# Altium schematic sheet 垃圾分类.SchDoc
size A2
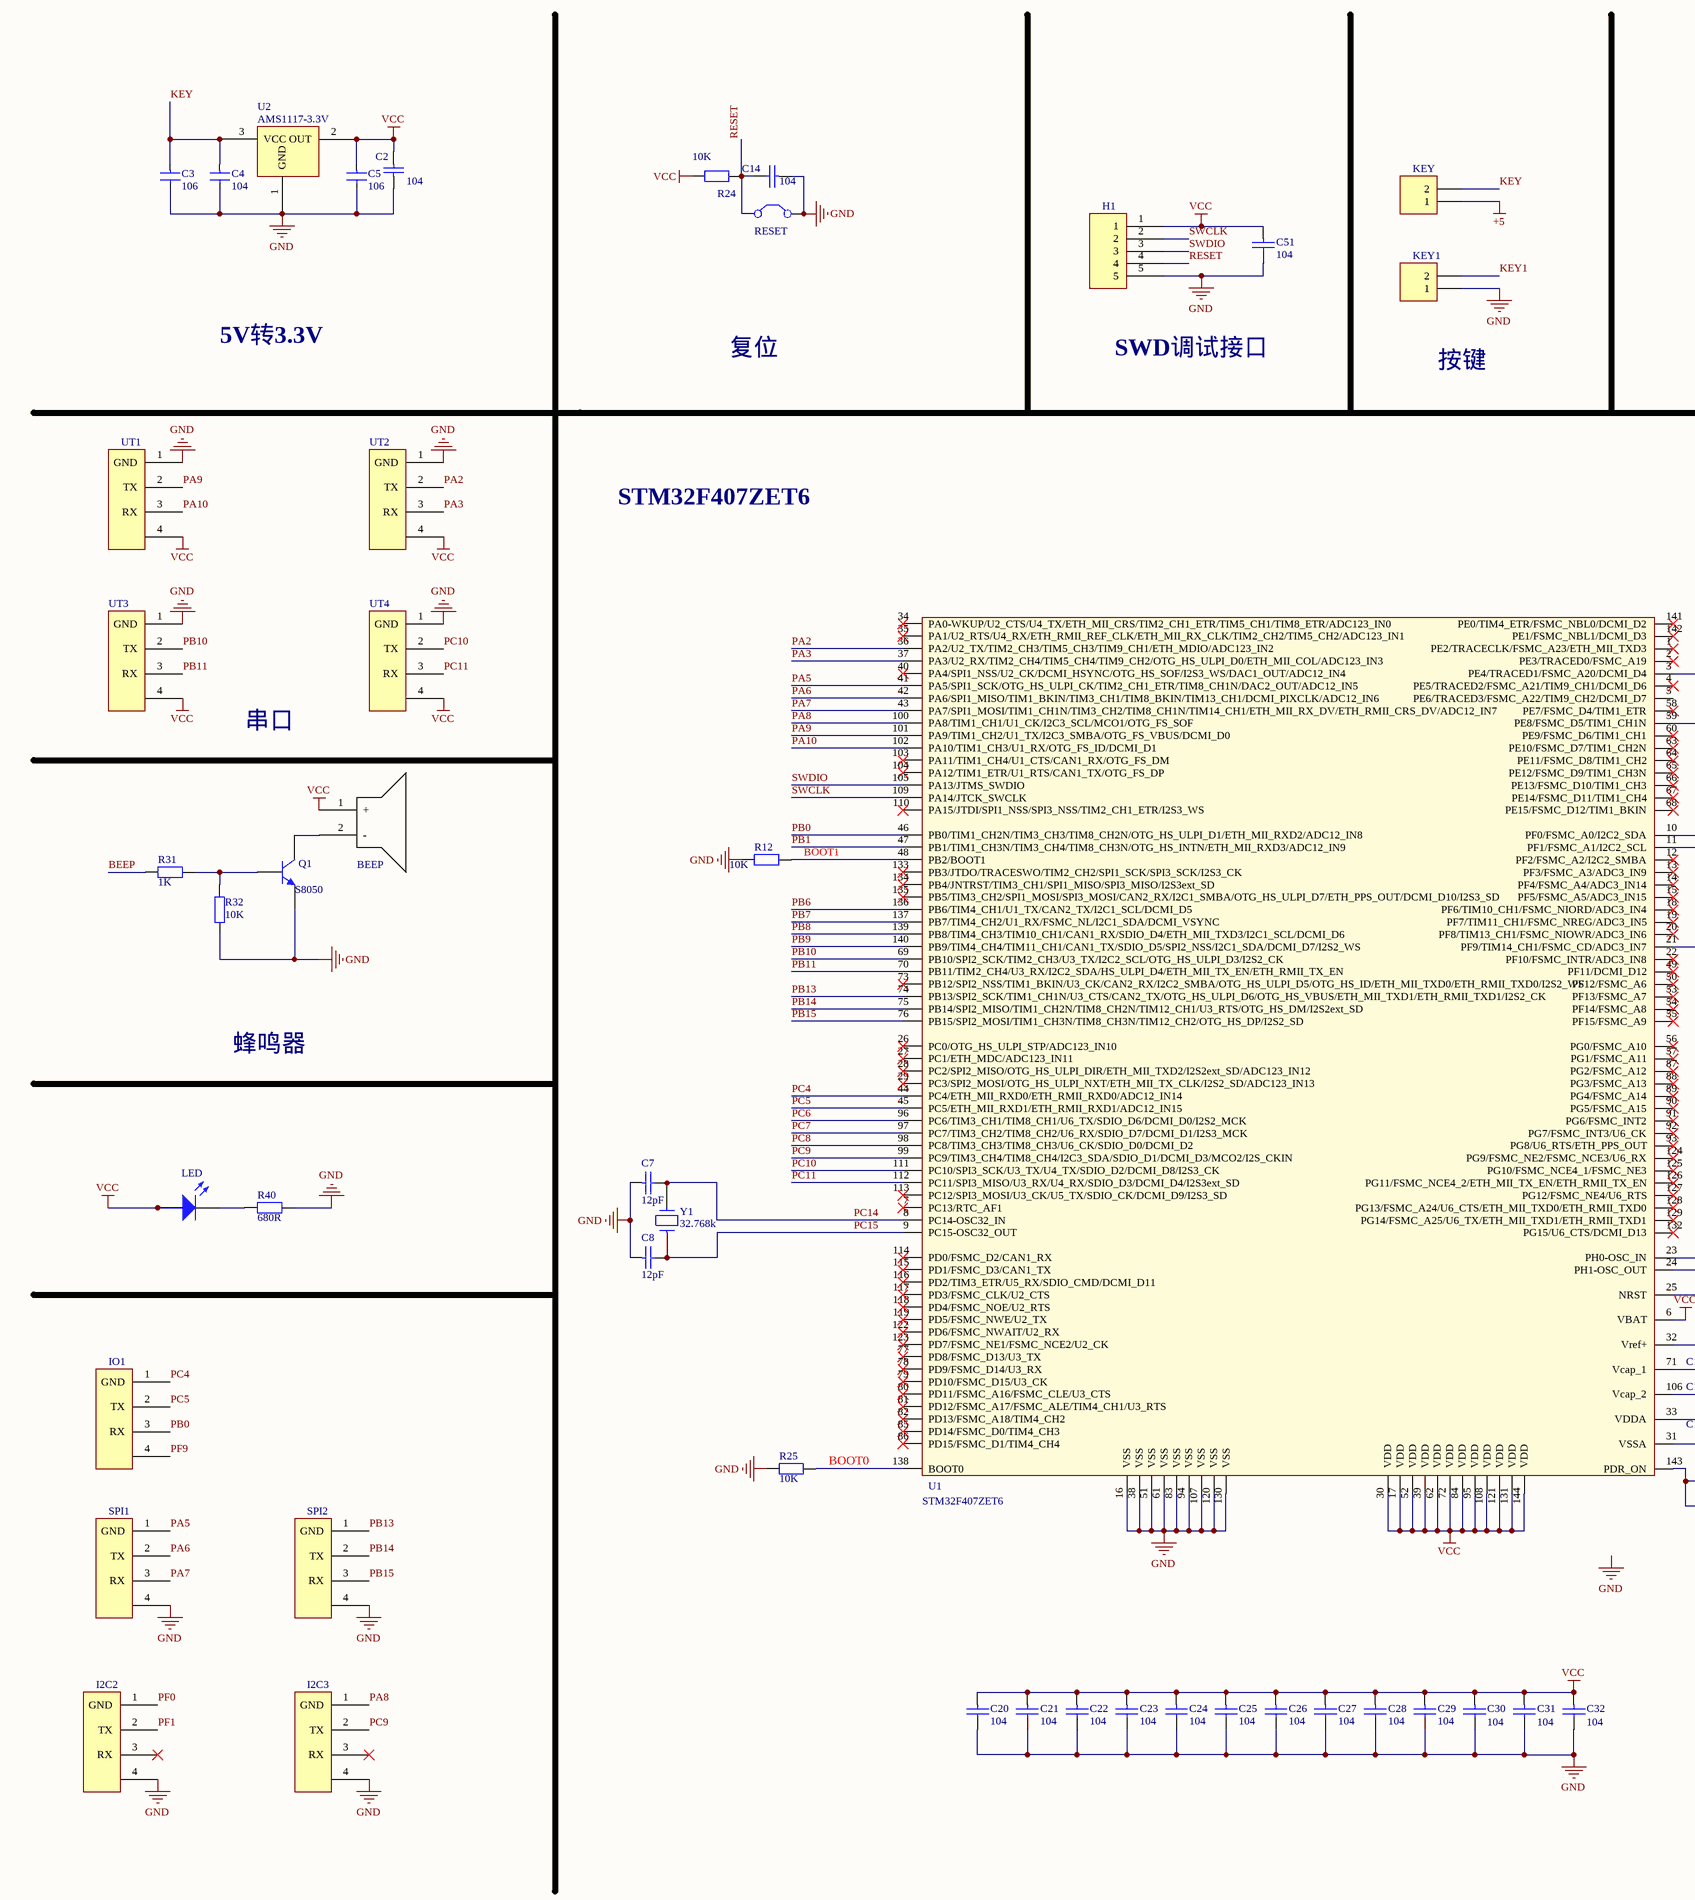
[diagram p0: 垃圾分类.SchDoc, left]
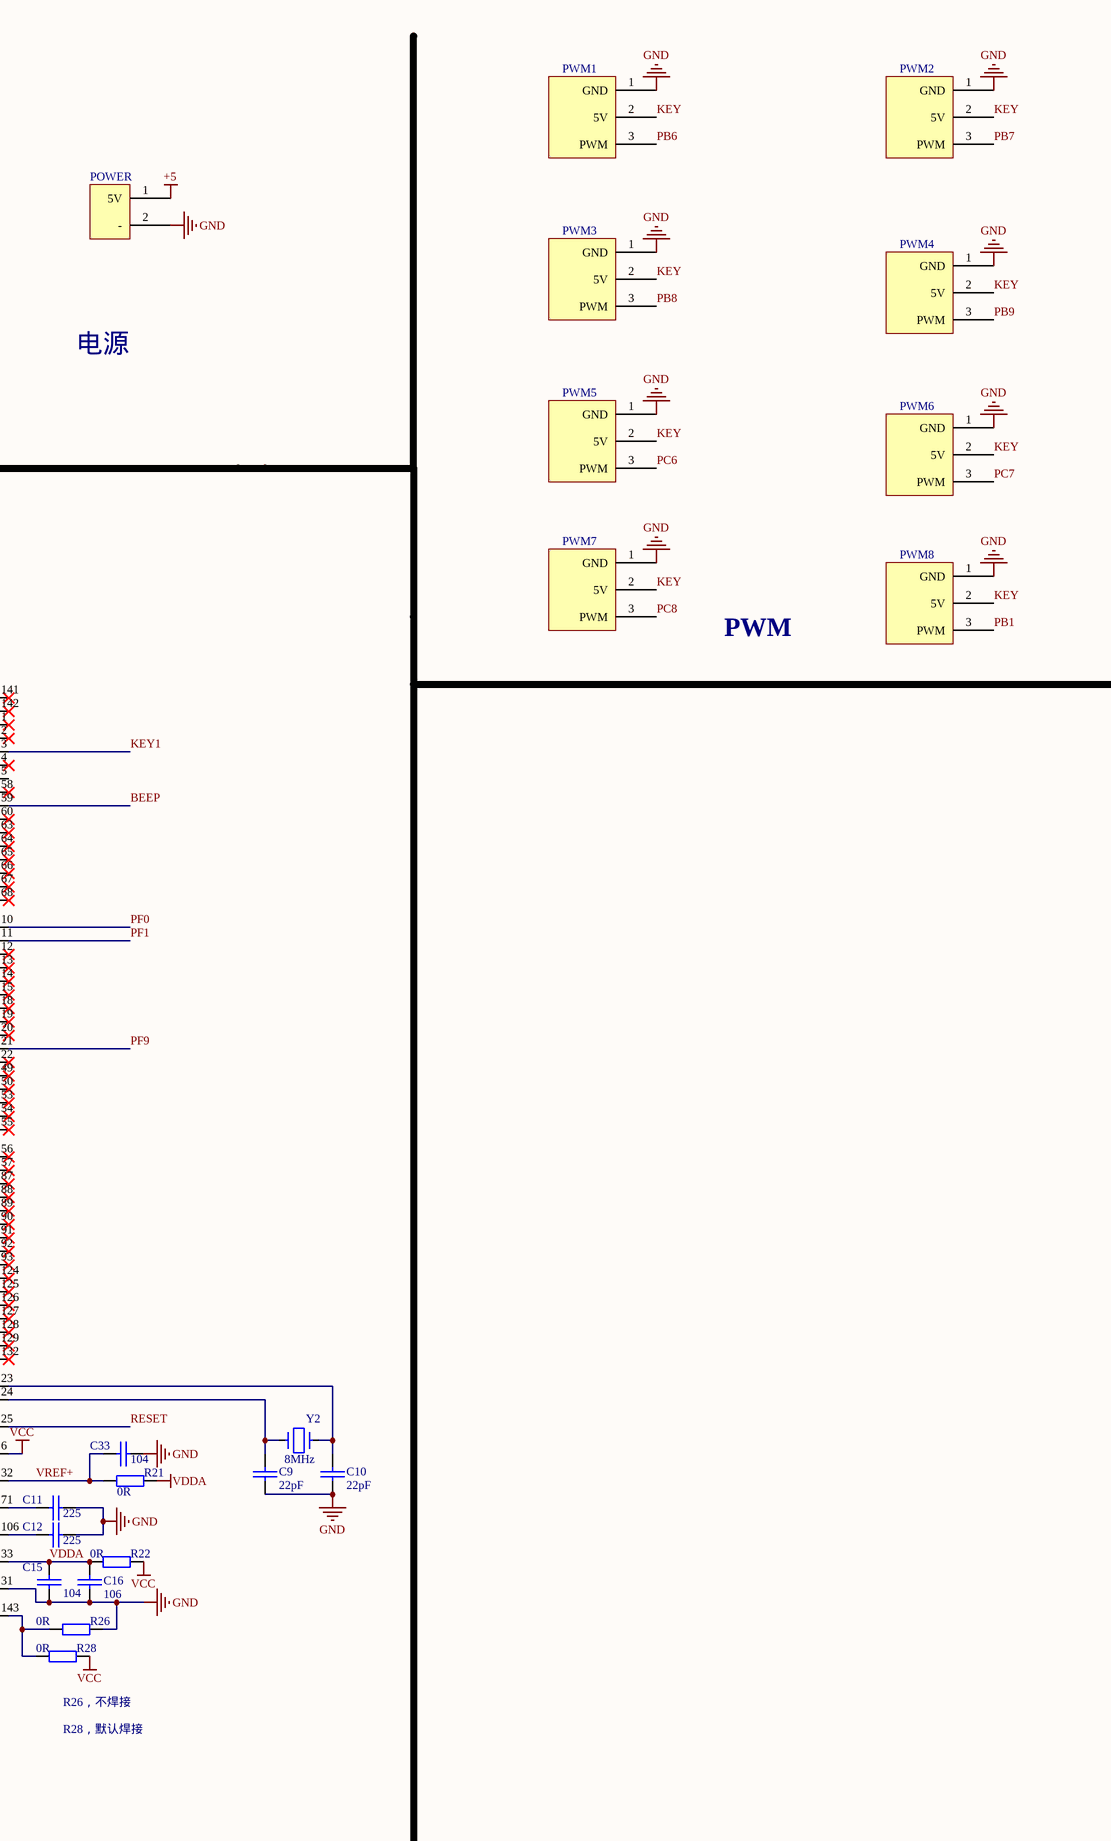
[diagram p1: 垃圾分类.SchDoc, right]

## Parts
BEEP  (no value)  [蜂鸣器]
C2  104  [C0805]
C3  106  [C0805]
C4  104  [C0805]
C5  106  [C0805]
C7  12pF  [C0805]
C8  12pF  [C0805]
C9  22pF  [C0805]
C10  22pF  [C0805]
C11  225  [C0805]
C12  225  [C0805]
C14  104  [C0805]
C15  104  [C0805]
C16  106  [C0805]
C20  104  [C0805]
C21  104  [C0805]
C22  104  [C0805]
C23  104  [C0805]
C24  104  [C0805]
C25  104  [C0805]
C26  104  [C0805]
C27  104  [C0805]
C28  104  [C0805]
C29  104  [C0805]
C30  104  [C0805]
C31  104  [C0805]
C32  104  [C0805]
C33  104  [C0805]
C51  104  [C0805]
H1  (no value)  [牛角座2.54-2x5P]
I2C2  (no value)  [GH1.25_4P]
I2C3  (no value)  [GH1.25_4P]
IO1  (no value)  [GH1.25_4P]
KEY  (no value)  [Porwer]
KEY1  (no value)  [Porwer]
LED  (no value)  [LED0805BLUE]
POWER  (no value)  [Porwer]
PWM1  (no value)  [PWM]
PWM2  (no value)  [PWM]
PWM3  (no value)  [PWM]
PWM4  (no value)  [PWM]
PWM5  (no value)  [PWM]
PWM6  (no value)  [PWM]
PWM7  (no value)  [PWM]
PWM8  (no value)  [PWM]
Q1  S8050  [S8050]
R12  10K  [R0805]
R21  0R  [R0805]
R22  0R  [R0805]
R24  10K  [R0805]
R25  10K  [R0805]
R26  0R  [R0805]
R28  0R  [R0805]
R31  1K  [R0805]
R32  10K  [R0805]
R40  680R  [R0805]
RESET  Key  [KEY - duplicate]  (value not drawn)
SPI1  (no value)  [GH1.25_4P]
SPI2  (no value)  [GH1.25_4P]
U1  STM32F407ZET6  [LQFP144N]
U2  AMS1117-3.3V  [ASM1117（yyh）]
UT1  (no value)  [GH1.25_4P]
UT2  (no value)  [GH1.25_4P]
UT3  (no value)  [GH1.25_4P]
UT4  (no value)  [GH1.25_4P]
Y1  32.768k  [晶振（32.768MHz）]
Y2  8MHz  [晶振（8MHz）]

## Nets
+5: KEY.1 POWER.1(5V)
GND: C2.2 C3.2 C4.2 C5.2 C7.1 C8.1 C9.2 C10.2 C11.2 C12.2 C14.1 C15.1 C16.1 C20.2 C21.2 C22.2 C23.2 C24.2 C25.2 C26.2 C27.2 C28.2 C29.2 C30.2 C31.2 C32.2 C33.2 C51.2 H1.5 I2C2.4 I2C3.4 KEY1.1 POWER.2(-) PWM1.1(GND) PWM2.1(GND) PWM3.1(GND) PWM4.1(GND) PWM5.1(GND) PWM6.1(GND) PWM7.1(GND) PWM8.1(GND) Q1.1(E) R12.2 R25.2 R26.2 R32.1 R40.1 RESET.2(C2) SPI1.4 SPI2.4 U1.16(VSS) U1.31(VSSA) U1.38(VSS) U1.51(VSS) U1.61(VSS) U1.83(VSS) U1.94(VSS) U1.107(VSS) U1.120(VSS) U1.130(VSS) U2.1(GND) UT1.1(GND) UT2.1(GND) UT3.1(GND) UT4.1(GND)
VCC: BEEP.1(+) C2.1 C5.1 C20.1 C21.1 C22.1 C23.1 C24.1 C25.1 C26.1 C27.1 C28.1 C29.1 C30.1 C31.1 C32.1 C51.1 H1.1 LED.1(A) R22.2 R24.2 R28.2 U1.6(VBAT) U1.17(VDD) U1.30(VDD) U1.39(VDD) U1.52(VDD) U1.62(VDD) U1.72(VDD) U1.84(VDD) U1.95(VDD) U1.108(VDD) U1.121(VDD) U1.131(VDD) U1.144(VDD) U2.2(OUT) UT1.4 UT2.4 UT3.4 UT4.4
VDDA: C15.2 C16.2 R21.2 R22.1 U1.33(VDDA)
BEEP: R31.1 U1.59(PE8/FSMC_D5/TIM1_CH1N)
BOOT0: R25.1 U1.138(BOOT0)
BOOT1: R12.1 U1.48(PB2/BOOT1)
KEY: C3.1 C4.1 KEY.2 PWM1.2(5V) PWM2.2(5V) PWM3.2(5V) PWM4.2(5V) PWM5.2(5V) PWM6.2(5V) PWM7.2(5V) PWM8.2(5V) U2.3(VCC)
KEY1: KEY1.2 U1.3(PE4/TRACED1/FSMC_A20/DCMI_D4)
PA2: U1.36(PA2/U2_TX/TIM2_CH3/TIM5_CH3/TIM9_CH1/ETH_MDIO/ADC123_IN2) UT2.2(TX)
PA3: U1.37(PA3/U2_RX/TIM2_CH4/TIM5_CH4/TIM9_CH2/OTG_HS_ULPI_D0/ETH_MII_COL/ADC123_IN3) UT2.3(RX)
PA5: SPI1.1(GND) U1.41(PA5/SPI1_SCK/OTG_HS_ULPI_CK/TIM2_CH1_ETR/TIM8_CH1N/DAC2_OUT/ADC12_IN5)
PA6: SPI1.2(TX) U1.42(PA6/SPI1_MISO/TIM1_BKIN/TIM3_CH1/TIM8_BKIN/TIM13_CH1/DCMI_PIXCLK/ADC12_IN6)
PA7: SPI1.3(RX) U1.43(PA7/SPI1_MOSI/TIM1_CH1N/TIM3_CH2/TIM8_CH1N/TIM14_CH1/ETH_MII_RX_DV/ETH_RMII_CRS_DV/ADC12_IN7)
PA8: I2C3.1(GND) U1.100(PA8/TIM1_CH1/U1_CK/I2C3_SCL/MCO1/OTG_FS_SOF)
PA9: U1.101(PA9/TIM1_CH2/U1_TX/I2C3_SMBA/OTG_FS_VBUS/DCMI_D0) UT1.2(TX)
PA10: U1.102(PA10/TIM1_CH3/U1_RX/OTG_FS_ID/DCMI_D1) UT1.3(RX)
PB0: IO1.3(RX) U1.46(PB0/TIM1_CH2N/TIM3_CH3/TIM8_CH2N/OTG_HS_ULPI_D1/ETH_MII_RXD2/ADC12_IN8)
PB1: PWM8.3(PWM) U1.47(PB1/TIM1_CH3N/TIM3_CH4/TIM8_CH3N/OTG_HS_INTN/ETH_MII_RXD3/ADC12_IN9)
PB6: PWM1.3(PWM) U1.136(PB6/TIM4_CH1/U1_TX/CAN2_TX/I2C1_SCL/DCMI_D5)
PB7: PWM2.3(PWM) U1.137(PB7/TIM4_CH2/U1_RX/FSMC_NL/I2C1_SDA/DCMI_VSYNC)
PB8: PWM3.3(PWM) U1.139(PB8/TIM4_CH3/TIM10_CH1/CAN1_RX/SDIO_D4/ETH_MII_TXD3/I2C1_SCL/DCMI_D6)
PB9: PWM4.3(PWM) U1.140(PB9/TIM4_CH4/TIM11_CH1/CAN1_TX/SDIO_D5/SPI2_NSS/I2C1_SDA/DCMI_D7/I2S2_WS)
PB10: U1.69(PB10/SPI2_SCK/TIM2_CH3/U3_TX/I2C2_SCL/OTG_HS_ULPI_D3/I2S2_CK) UT3.2(TX)
PB11: U1.70(PB11/TIM2_CH4/U3_RX/I2C2_SDA/HS_ULPI_D4/ETH_MII_TX_EN/ETH_RMII_TX_EN) UT3.3(RX)
PB13: SPI2.1(GND) U1.74(PB13/SPI2_SCK/TIM1_CH1N/U3_CTS/CAN2_TX/OTG_HS_ULPI_D6/OTG_HS_VBUS/ETH_MII_TXD1/ETH_RMII_TXD1/I2S2_CK)
PB14: SPI2.2(TX) U1.75(PB14/SPI2_MISO/TIM1_CH2N/TIM8_CH2N/TIM12_CH1/U3_RTS/OTG_HS_DM/I2S2ext_SD)
PB15: SPI2.3(RX) U1.76(PB15/SPI2_MOSI/TIM1_CH3N/TIM8_CH3N/TIM12_CH2/OTG_HS_DP/I2S2_SD)
PC4: IO1.1(GND) U1.44(PC4/ETH_MII_RXD0/ETH_RMII_RXD0/ADC12_IN14)
PC5: IO1.2(TX) U1.45(PC5/ETH_MII_RXD1/ETH_RMII_RXD1/ADC12_IN15)
PC6: PWM5.3(PWM) U1.96(PC6/TIM3_CH1/TIM8_CH1/U6_TX/SDIO_D6/DCMI_D0/I2S2_MCK)
PC7: PWM6.3(PWM) U1.97(PC7/TIM3_CH2/TIM8_CH2/U6_RX/SDIO_D7/DCMI_D1/I2S3_MCK)
PC8: PWM7.3(PWM) U1.98(PC8/TIM3_CH3/TIM8_CH3/U6_CK/SDIO_D0/DCMI_D2)
PC9: I2C3.2(TX) U1.99(PC9/TIM3_CH4/TIM8_CH4/I2C3_SDA/SDIO_D1/DCMI_D3/MCO2/I2S_CKIN)
PC10: U1.111(PC10/SPI3_SCK/U3_TX/U4_TX/SDIO_D2/DCMI_D8/I2S3_CK) UT4.2(TX)
PC11: U1.112(PC11/SPI3_MISO/U3_RX/U4_RX/SDIO_D3/DCMI_D4/I2S3ext_SD) UT4.3(RX)
PC14: C7.2 U1.8(PC14-OSC32_IN) Y1.2
PC15: C8.2 U1.9(PC15-OSC32_OUT) Y1.1
PF0: I2C2.1(GND) U1.10(PF0/FSMC_A0/I2C2_SDA)
PF1: I2C2.2(TX) U1.11(PF1/FSMC_A1/I2C2_SCL)
PF9: IO1.4 U1.21(PF9/TIM14_CH1/FSMC_CD/ADC3_IN7)
RESET: C14.2 H1.4 R24.1 RESET.1(C1) U1.25(NRST)
SWCLK: H1.2 U1.109(PA14/JTCK_SWCLK)
SWDIO: H1.3 U1.105(PA13/JTMS_SWDIO)
VREF+: C33.1 R21.1 U1.32(Vref+)
NetBEEP_2: BEEP.2(-) Q1.3(C)
NetC9_1: C9.1 U1.24(PH1-OSC_OUT) Y2.2
NetC10_1: C10.1 U1.23(PH0-OSC_IN) Y2.1
NetC11_1: C11.1 U1.71(Vcap_1)
NetC12_1: C12.1 U1.106(Vcap_2)
NetLED_2: LED.2(K) R40.2
NetQ1_2: Q1.2(B) R31.2 R32.2
NetR26_1: R26.1 R28.1 U1.143(PDR_ON)

Not connected (* = marked no-connect by the designer): I2C2 3(RX)*; I2C3 3(RX)*; U1 1(PE2/TRACECLK/FSMC_A23/ETH_MII_TXD3)* 2(PE3/TRACED0/FSMC_A19)* 4(PE5/TRACED2/FSMC_A21/TIM9_CH1/DCMI_D6)* 5(PE6/TRACED3/FSMC_A22/TIM9_CH2/DCMI_D7) 7(PC13/RTC_AF1)* 12(PF2/FSMC_A2/I2C2_SMBA)* 13(PF3/FSMC_A3/ADC3_IN9)* 14(PF4/FSMC_A4/ADC3_IN14)* 15(PF5/FSMC_A5/ADC3_IN15)* 18(PF6/TIM10_CH1/FSMC_NIORD/ADC3_IN4)* 19(PF7/TIM11_CH1/FSMC_NREG/ADC3_IN5)* 20(PF8/TIM13_CH1/FSMC_NIOWR/ADC3_IN6)* 22(PF10/FSMC_INTR/ADC3_IN8)* 26(PC0/OTG_HS_ULPI_STP/ADC123_IN10)* 27(PC1/ETH_MDC/ADC123_IN11)* 28(PC2/SPI2_MISO/OTG_HS_ULPI_DIR/ETH_MII_TXD2/I2S2ext_SD/ADC123_IN12)* 29(PC3/SPI2_MOSI/OTG_HS_ULPI_NXT/ETH_MII_TX_CLK/I2S2_SD/ADC123_IN13)* 34(PA0-WKUP/U2_CTS/U4_TX/ETH_MII_CRS/TIM2_CH1_ETR/TIM5_CH1/TIM8_ETR/ADC123_IN0)* 35(PA1/U2_RTS/U4_RX/ETH_RMII_REF_CLK/ETH_MII_RX_CLK/TIM2_CH2/TIM5_CH2/ADC123_IN1)* 40(PA4/SPI1_NSS/U2_CK/DCMI_HSYNC/OTG_HS_SOF/I2S3_WS/DAC1_OUT/ADC12_IN4)* 49(PF11/DCMI_D12)* 50(PF12/FSMC_A6)* 53(PF13/FSMC_A7)* 54(PF14/FSMC_A8)* 55(PF15/FSMC_A9)* 56(PG0/FSMC_A10)* 57(PG1/FSMC_A11)* 58(PE7/FSMC_D4/TIM1_ETR)* 60(PE9/FSMC_D6/TIM1_CH1)* 63(PE10/FSMC_D7/TIM1_CH2N)* 64(PE11/FSMC_D8/TIM1_CH2)* 65(PE12/FSMC_D9/TIM1_CH3N)* 66(PE13/FSMC_D10/TIM1_CH3)* 67(PE14/FSMC_D11/TIM1_CH4)* 68(PE15/FSMC_D12/TIM1_BKIN)* 73(PB12/SPI2_NSS/TIM1_BKIN/U3_CK/CAN2_RX/I2C2_SMBA/OTG_HS_ULPI_D5/OTG_HS_ID/ETH_MII_TXD0/ETH_RMII_TXD0/I2S2_WS)* 77(PD8/FSMC_D13/U3_TX)* 78(PD9/FSMC_D14/U3_RX)* 79(PD10/FSMC_D15/U3_CK)* 80(PD11/FSMC_A16/FSMC_CLE/U3_CTS)* 81(PD12/FSMC_A17/FSMC_ALE/TIM4_CH1/U3_RTS)* 82(PD13/FSMC_A18/TIM4_CH2)* 85(PD14/FSMC_D0/TIM4_CH3)* 86(PD15/FSMC_D1/TIM4_CH4)* 87(PG2/FSMC_A12)* 88(PG3/FSMC_A13)* 89(PG4/FSMC_A14)* 90(PG5/FSMC_A15)* 91(PG6/FSMC_INT2)* 92(PG7/FSMC_INT3/U6_CK)* 93(PG8/U6_RTS/ETH_PPS_OUT)* 103(PA11/TIM1_CH4/U1_CTS/CAN1_RX/OTG_FS_DM)* 104(PA12/TIM1_ETR/U1_RTS/CAN1_TX/OTG_FS_DP)* 110(PA15/JTDI/SPI1_NSS/SPI3_NSS/TIM2_CH1_ETR/I2S3_WS)* 113(PC12/SPI3_MOSI/U3_CK/U5_TX/SDIO_CK/DCMI_D9/I2S3_SD)* 114(PD0/FSMC_D2/CAN1_RX)* 115(PD1/FSMC_D3/CAN1_TX)* 116(PD2/TIM3_ETR/U5_RX/SDIO_CMD/DCMI_D11)* 117(PD3/FSMC_CLK/U2_CTS)* 118(PD4/FSMC_NOE/U2_RTS)* 119(PD5/FSMC_NWE/U2_TX)* 122(PD6/FSMC_NWAIT/U2_RX)* 123(PD7/FSMC_NE1/FSMC_NCE2/U2_CK)* 124(PG9/FSMC_NE2/FSMC_NCE3/U6_RX)* 125(PG10/FSMC_NCE4_1/FSMC_NE3)* 126(PG11/FSMC_NCE4_2/ETH_MII_TX_EN/ETH_RMII_TX_EN)* 127(PG12/FSMC_NE4/U6_RTS)* 128(PG13/FSMC_A24/U6_CTS/ETH_MII_TXD0/ETH_RMII_TXD0)* 129(PG14/FSMC_A25/U6_TX/ETH_MII_TXD1/ETH_RMII_TXD1)* 132(PG15/U6_CTS/DCMI_D13)* 133(PB3/JTDO/TRACESWO/TIM2_CH2/SPI1_SCK/SPI3_SCK/I2S3_CK)* 134(PB4/JNTRST/TIM3_CH1/SPI1_MISO/SPI3_MISO/I2S3ext_SD)* 135(PB5/TIM3_CH2/SPI1_MOSI/SPI3_MOSI/CAN2_RX/I2C1_SMBA/OTG_HS_ULPI_D7/ETH_PPS_OUT/DCMI_D10/I2S3_SD)* 141(PE0/TIM4_ETR/FSMC_NBL0/DCMI_D2)* 142(PE1/FSMC_NBL1/DCMI_D3)*

## Notes on the sheet
- 电源
- 5V转3.3V
- 复位
- SWD调试接口
- 按键
- STM32F407ZET6
- PWM
- 串口
- 蜂鸣器
- (near R28) R26，不焊接
- R28，默认焊接
- Labels drawn without touching a wire or pin: GND

## Library data of the parts
BEEP = BEEP
C2 = Cap: Capacitor; Published: 8-Jun-2000; LatestRevisionDate: 17-Jul-2002; LatestRevisionNote: Re-released for DXP Platform.; PackageReference: RAD-0.3; Publisher: Altium Limited
C3-C5 = 0805C: Capacitor; 0805: pf
C7-C12 C14-C16 C20-C33 C51 = CAP: Capcitor
H1 = SWD: pin to pad: 1>8 2>6 3>2 4>1 5>4
I2C2 IO1 SPI1 SPI2 UT2-UT4 = GH1.25_4P_ckou
I2C3 = GH1.25_4P_ckou: pin to pad: 1>2 2>1
KEY = Header 2: Header, 2-Pin; pin to pad: 1>2 2>1; LatestRevisionDate: 17-Jul-2002; LatestRevisionNote: Re-released for DXP Platform.; Publisher: Altium Limited
KEY1 = Header 2: Header, 2-Pin; LatestRevisionDate: 17-Jul-2002; LatestRevisionNote: Re-released for DXP Platform.; Publisher: Altium Limited
LED = LED2: Typical RED, GREEN, YELLOW, AMBER GaAs LED; Published: 8-Jun-2000; LatestRevisionDate: 17-Jul-2002; LatestRevisionNote: Re-released for DXP Platform.; PackageVersion: Feb-2002; PackageReference: 3.2X1.6X1.1; Publisher: Altium Limited; PackageDescription: SM LED; 2 Flat Leads
POWER = dianyuan
PWM1-PWM8 = pwm
Q1 = 2N3904: NPN General Purpose Amplifier; Published: 8-Jun-2000; LatestRevisionDate: 15-Jan-2003; LatestRevisionNote: PCB Footprint 'BCY-W3/D4.7' replaced; DatasheetVersion: 1997; PackageVersion: Sep-1998; PackageReference: TO-92A; Publisher: Altium Limited; PackageDescription: TO, Flat Index; 3 In-Line, Axial Leads; Body Dia. 4.5mm; Leads 0.51 x 0.48 mm (max); ComponentLink1Description: Manufacturer Link; ComponentLink1URL: http://www.fairchildsemi.com/; ComponentLink2Description: Datasheet; ComponentLink2URL: http://www.fairchildsemi.com/ds/2N%2F2N3904.pdf
R12 R21 R22 R24-R26 R28 R31 R32 R40 = Res2: Resistor
RESET = Jumper: Jumper Wire; Published: 24-Mar-1999; LatestRevisionDate: 17-Jul-2002; LatestRevisionNote: Re-released for DXP Platform.; PackageReference: RAD-0.2; Publisher: Altium Limited
U2 = 11: pin to pad: 2>4
UT1 = GH1.25_4P_ckou: pin to pad: 2>3 3>2
Y1 = CRYSTAL: Crystal 8MHz PLUG; pin to pad: 1>2 2>1; Value: 8MHz
Y2 = XTAL: Crystal Oscillator